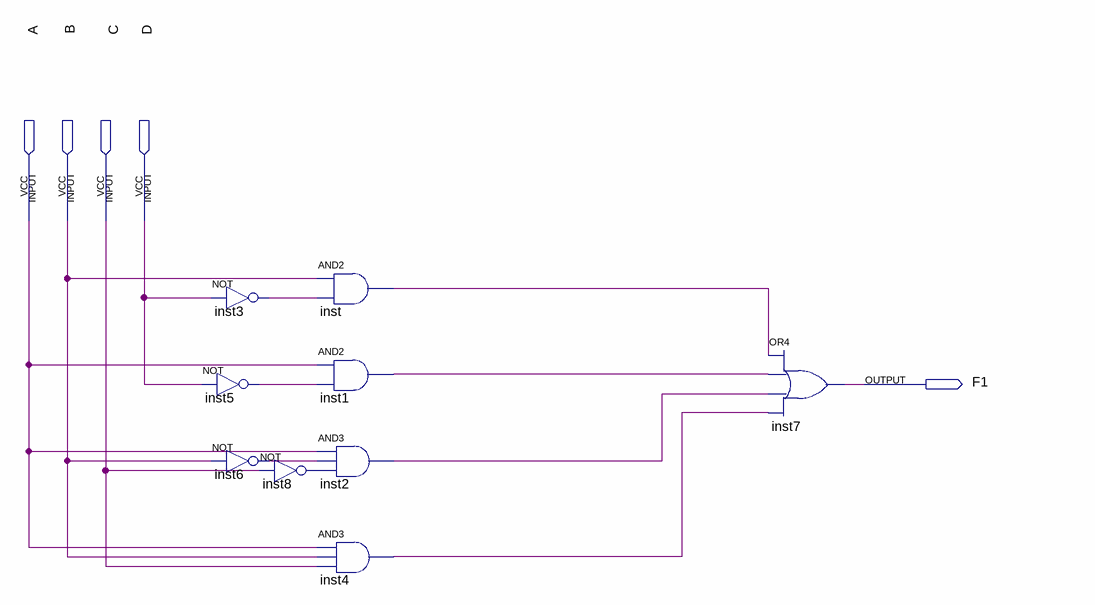
[diagram p0: schematic sheet]
// Quartus schematic HW41.bdf as structural Verilog: 9 symbols, 5 pins
module HW41 (
  input  A,
  input  B,
  input  C,
  input  D,
  output F1
);

  wire inst1_out, inst2_out, inst3_out, inst4_out, inst5_out, inst6_out, inst8_out, inst_out;

  not inst3 (inst3_out, D);
  not inst5 (inst5_out, D);
  not inst6 (inst6_out, B);
  and inst (inst_out, B, inst3_out);
  and inst1 (inst1_out, A, inst5_out);
  and inst2 (inst2_out, A, inst6_out, inst8_out);
  not inst8 (inst8_out, C);
  and inst4 (inst4_out, A, B, C);
  or inst7 (F1, inst_out, inst1_out, inst2_out, inst4_out);
endmodule
